# Altium schematic sheet 08-NANDStatusLed.SchDoc
size A4
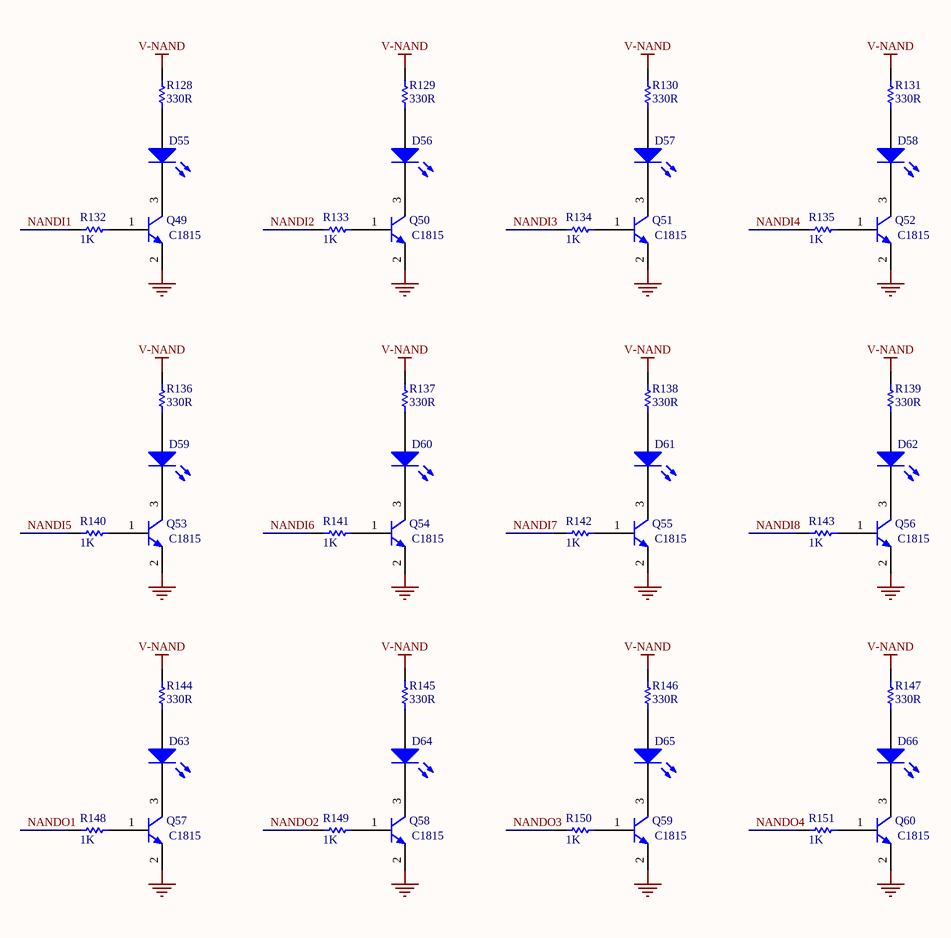
[diagram p0: 08-NANDStatusLed.SchDoc]

## Parts
D55  LED  [LED-3528]  (value not drawn)
D56  LED  [LED-3528]  (value not drawn)
D57  LED  [LED-3528]  (value not drawn)
D58  LED  [LED-3528]  (value not drawn)
D59  LED  [LED-3528]  (value not drawn)
D60  LED  [LED-3528]  (value not drawn)
D61  LED  [LED-3528]  (value not drawn)
D62  LED  [LED-3528]  (value not drawn)
D63  LED  [LED-3528]  (value not drawn)
D64  LED  [LED-3528]  (value not drawn)
D65  LED  [LED-3528]  (value not drawn)
D66  LED  [LED-3528]  (value not drawn)
Q49  value C1815  [SOT23-321]  (hidden comment: C1815-SMD)
Q50  value C1815  [SOT23-321]  (hidden comment: C1815-SMD)
Q51  value C1815  [SOT23-321]  (hidden comment: C1815-SMD)
Q52  value C1815  [SOT23-321]  (hidden comment: C1815-SMD)
Q53  value C1815  [SOT23-321]  (hidden comment: C1815-SMD)
Q54  value C1815  [SOT23-321]  (hidden comment: C1815-SMD)
Q55  value C1815  [SOT23-321]  (hidden comment: C1815-SMD)
Q56  value C1815  [SOT23-321]  (hidden comment: C1815-SMD)
Q57  value C1815  [SOT23-321]  (hidden comment: C1815-SMD)
Q58  value C1815  [SOT23-321]  (hidden comment: C1815-SMD)
Q59  value C1815  [SOT23-321]  (hidden comment: C1815-SMD)
Q60  value C1815  [SOT23-321]  (hidden comment: C1815-SMD)
R128  330R  [R-0805]
R129  330R  [R-0805]
R130  330R  [R-0805]
R131  330R  [R-0805]
R132  1K  [R-0805]
R133  1K  [R-0805]
R134  1K  [R-0805]
R135  1K  [R-0805]
R136  330R  [R-0805]
R137  330R  [R-0805]
R138  330R  [R-0805]
R139  330R  [R-0805]
R140  1K  [R-0805]
R141  1K  [R-0805]
R142  1K  [R-0805]
R143  1K  [R-0805]
R144  330R  [R-0805]
R145  330R  [R-0805]
R146  330R  [R-0805]
R147  330R  [R-0805]
R148  1K  [R-0805]
R149  1K  [R-0805]
R150  1K  [R-0805]
R151  1K  [R-0805]

## Nets
GND: Q49.2(E) Q50.2(E) Q51.2(E) Q52.2(E) Q53.2(E) Q54.2(E) Q55.2(E) Q56.2(E) Q57.2(E) Q58.2(E) Q59.2(E) Q60.2(E)
V-NAND: R128.2 R129.2 R130.2 R131.2 R136.2 R137.2 R138.2 R139.2 R144.2 R145.2 R146.2 R147.2
NANDI1: R132.2
NANDI2: R133.2
NANDI3: R134.2
NANDI4: R135.2
NANDI5: R140.2
NANDI6: R141.2
NANDI7: R142.2
NANDI8: R143.2
NANDO1: R148.2
NANDO2: R149.2
NANDO3: R150.2
NANDO4: R151.2
NetD55_1: D55.1(A) R128.1
NetD55_2: D55.2(K) Q49.3(C)
NetD56_1: D56.1(A) R129.1
NetD56_2: D56.2(K) Q50.3(C)
NetD57_1: D57.1(A) R130.1
NetD57_2: D57.2(K) Q51.3(C)
NetD58_1: D58.1(A) R131.1
NetD58_2: D58.2(K) Q52.3(C)
NetD59_1: D59.1(A) R136.1
NetD59_2: D59.2(K) Q53.3(C)
NetD60_1: D60.1(A) R137.1
NetD60_2: D60.2(K) Q54.3(C)
NetD61_1: D61.1(A) R138.1
NetD61_2: D61.2(K) Q55.3(C)
NetD62_1: D62.1(A) R139.1
NetD62_2: D62.2(K) Q56.3(C)
NetD63_1: D63.1(A) R144.1
NetD63_2: D63.2(K) Q57.3(C)
NetD64_1: D64.1(A) R145.1
NetD64_2: D64.2(K) Q58.3(C)
NetD65_1: D65.1(A) R146.1
NetD65_2: D65.2(K) Q59.3(C)
NetD66_1: D66.1(A) R147.1
NetD66_2: D66.2(K) Q60.3(C)
NetQ49_1: Q49.1(B) R132.1
NetQ50_1: Q50.1(B) R133.1
NetQ51_1: Q51.1(B) R134.1
NetQ52_1: Q52.1(B) R135.1
NetQ53_1: Q53.1(B) R140.1
NetQ54_1: Q54.1(B) R141.1
NetQ55_1: Q55.1(B) R142.1
NetQ56_1: Q56.1(B) R143.1
NetQ57_1: Q57.1(B) R148.1
NetQ58_1: Q58.1(B) R149.1
NetQ59_1: Q59.1(B) R150.1
NetQ60_1: Q60.1(B) R151.1

## Library data of the parts
D55-D66 = LED2: Typical RED, GREEN, YELLOW, AMBER GaAs LED; Published: 8-Jun-2000; LatestRevisionDate: 17-Jul-2002; LatestRevisionNote: Re-released for DXP Platform.; PackageVersion: Feb-2002; PackageReference: 3.2X1.6X1.1; Publisher: Altium Limited; PackageDescription: SM LED; 2 Flat Leads
Q49-Q60 = NPN: NPN Bipolar Transistor; Published: 8-Jun-2000; LatestRevisionDate: 17-Jul-2002; LatestRevisionNote: Re-released for DXP Platform.; PackageReference: TO-226-AA; PackageDescription: TO, Flat Index; 3 In-Line, Axial Leads; Body Dia. 4.8mm; Leads 0.55 x 0.51 mm (max); Code_JEDEC: TO-226-AA
R128-R151 = Res1: Resistor; Published: 8-Jun-2000; LatestRevisionDate: 17-Jul-2002; LatestRevisionNote: Re-released for DXP Platform.; PackageReference: AXIAL-0.3; Publisher: Altium Limited; PackageDescription: Axial Device, Thru-Hole; 2 Leads; 0.3 in Pin Spacing
  R128-R131 R136-R139 R144-R147: Value: 330R
  R132-R135 R140-R143 R148-R151: Value: 1K